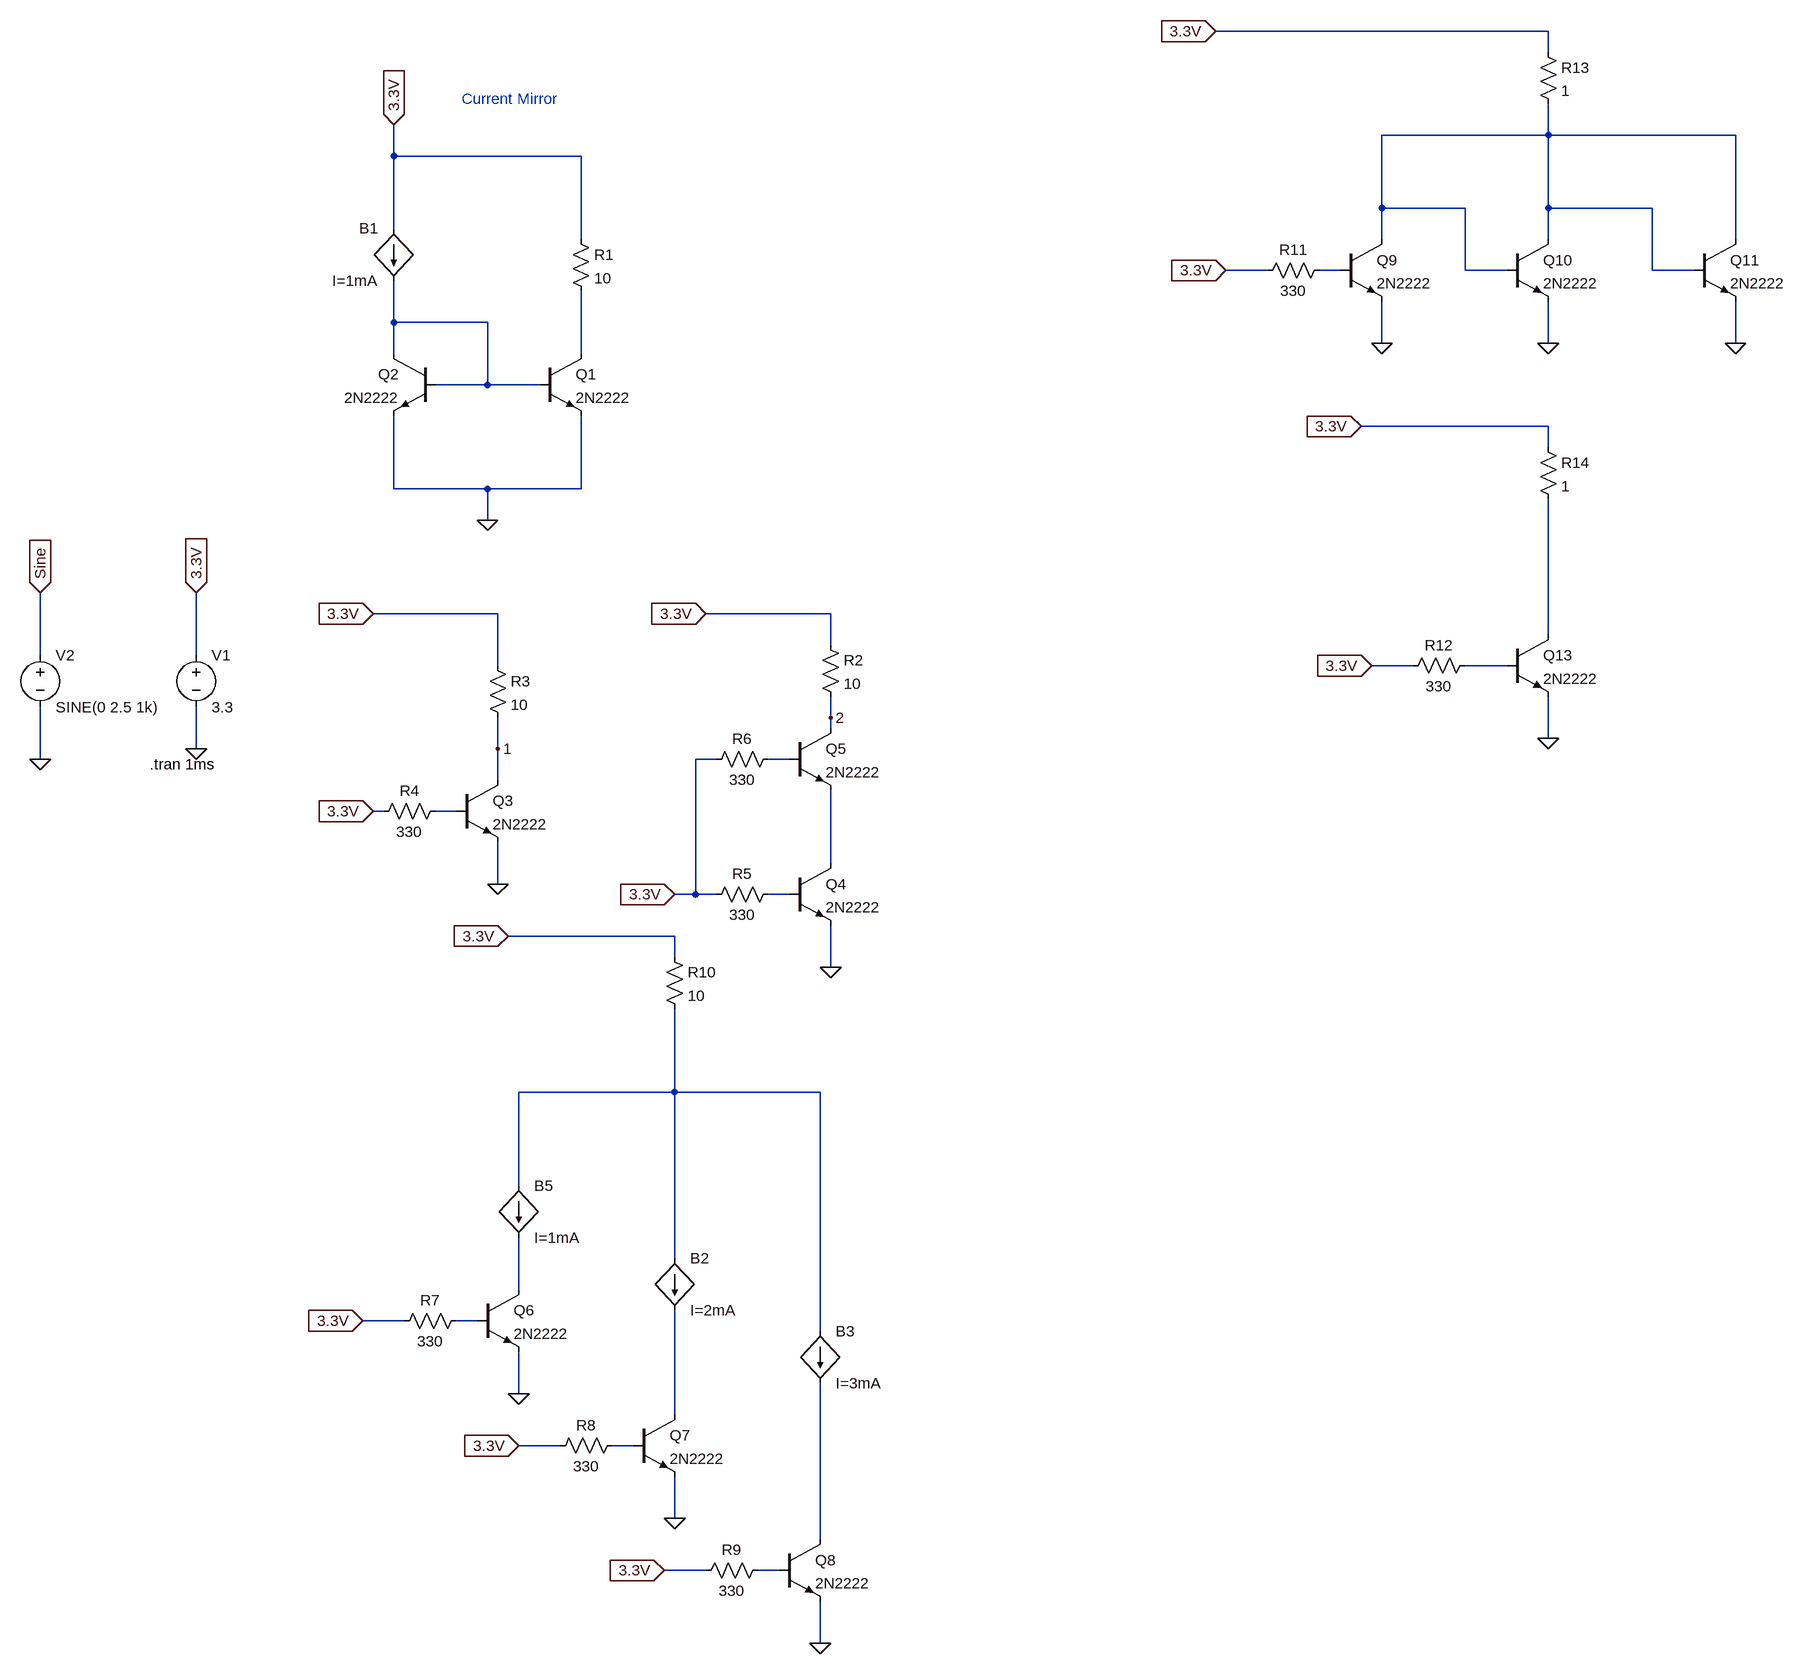
[diagram p0: schematic VLSI_Basic.asc]
VLSI_Basic.asc, the LTspice schematic file:
Version 4
SHEET 1 2536 1540
WIRE 2160 -960 1648 -960
WIRE 2160 -928 2160 -960
WIRE 2160 -800 2160 -848
WIRE 2160 -800 1904 -800
WIRE 2448 -800 2160 -800
WIRE 384 -768 384 -816
WIRE 672 -768 384 -768
WIRE 1904 -688 1904 -800
WIRE 2032 -688 1904 -688
WIRE 2160 -688 2160 -800
WIRE 2320 -688 2160 -688
WIRE 384 -656 384 -768
WIRE 672 -640 672 -768
WIRE 1904 -640 1904 -688
WIRE 2160 -640 2160 -688
WIRE 2448 -640 2448 -800
WIRE 1728 -592 1664 -592
WIRE 1840 -592 1808 -592
WIRE 2032 -592 2032 -688
WIRE 2096 -592 2032 -592
WIRE 2320 -592 2320 -688
WIRE 2384 -592 2320 -592
WIRE 384 -512 384 -576
WIRE 528 -512 384 -512
WIRE 1904 -480 1904 -544
WIRE 2160 -480 2160 -544
WIRE 2448 -480 2448 -544
WIRE 384 -464 384 -512
WIRE 672 -464 672 -560
WIRE 528 -416 528 -512
WIRE 528 -416 448 -416
WIRE 608 -416 528 -416
WIRE 2160 -352 1872 -352
WIRE 2160 -320 2160 -352
WIRE 384 -256 384 -368
WIRE 528 -256 384 -256
WIRE 672 -256 672 -368
WIRE 672 -256 528 -256
WIRE 528 -208 528 -256
WIRE 544 -64 352 -64
WIRE 1056 -64 864 -64
WIRE 2160 -32 2160 -240
WIRE 1056 -16 1056 -64
WIRE -160 0 -160 -96
WIRE 80 0 80 -96
WIRE 544 16 544 -64
WIRE 1952 16 1888 16
WIRE 2096 16 2032 16
WIRE 1056 96 1056 64
WIRE 1056 112 1056 96
WIRE 2160 128 2160 64
WIRE 80 144 80 80
WIRE 544 144 544 96
WIRE -160 160 -160 80
WIRE 880 160 848 160
WIRE 992 160 960 160
WIRE 544 192 544 144
WIRE 368 240 352 240
WIRE 480 240 448 240
WIRE 1056 320 1056 208
WIRE 544 352 544 288
WIRE 848 368 848 160
WIRE 848 368 816 368
WIRE 880 368 848 368
WIRE 992 368 960 368
WIRE 816 432 560 432
WIRE 816 464 816 432
WIRE 1056 480 1056 416
WIRE 816 672 816 544
WIRE 816 672 576 672
WIRE 1040 672 816 672
WIRE 576 816 576 672
WIRE 816 928 816 672
WIRE 576 976 576 896
WIRE 400 1024 336 1024
WIRE 512 1024 480 1024
WIRE 1040 1040 1040 672
WIRE 576 1136 576 1072
WIRE 816 1168 816 1008
WIRE 640 1216 576 1216
WIRE 752 1216 720 1216
WIRE 816 1328 816 1264
WIRE 1040 1360 1040 1120
WIRE 864 1408 800 1408
WIRE 976 1408 944 1408
WIRE 1040 1520 1040 1456
FLAG 80 144 0
FLAG 80 -96 3.3V
IOPIN 80 -96 In
FLAG 384 -816 3.3V
IOPIN 384 -816 In
FLAG 528 -208 0
FLAG 352 -64 3.3V
IOPIN 352 -64 In
FLAG 544 352 0
FLAG -160 160 0
FLAG -160 -96 Sine
IOPIN -160 -96 In
FLAG 864 -64 3.3V
IOPIN 864 -64 In
FLAG 1056 480 0
FLAG 352 240 3.3V
IOPIN 352 240 In
FLAG 816 368 3.3V
IOPIN 816 368 In
FLAG 544 144 1
FLAG 1056 96 2
FLAG 576 1136 0
FLAG 336 1024 3.3V
IOPIN 336 1024 In
FLAG 816 1328 0
FLAG 576 1216 3.3V
IOPIN 576 1216 In
FLAG 1040 1520 0
FLAG 800 1408 3.3V
IOPIN 800 1408 In
FLAG 560 432 3.3V
IOPIN 560 432 In
FLAG 1904 -480 0
FLAG 1664 -592 3.3V
IOPIN 1664 -592 In
FLAG 2160 -480 0
FLAG 2448 -480 0
FLAG 1648 -960 3.3V
IOPIN 1648 -960 In
FLAG 1888 16 3.3V
IOPIN 1888 16 In
FLAG 2160 128 0
FLAG 1872 -352 3.3V
IOPIN 1872 -352 In
SYMBOL voltage 80 -16 R0
SYMATTR InstName V1
SYMATTR Value 3.3
SYMBOL npn 608 -464 R0
SYMATTR InstName Q1
SYMATTR Value 2N2222
SYMBOL npn 448 -464 M0
SYMATTR InstName Q2
SYMATTR Value 2N2222
SYMBOL bi2 384 -576 R180
WINDOW 0 24 81 Left 2
WINDOW 3 24 0 Left 2
SYMATTR InstName B1
SYMATTR Value I=1mA
SYMBOL res 656 -656 R0
SYMATTR InstName R1
SYMATTR Value 10
SYMBOL npn 480 192 R0
SYMATTR InstName Q3
SYMATTR Value 2N2222
SYMBOL voltage -160 -16 R0
WINDOW 123 0 0 Left 0
WINDOW 39 0 0 Left 0
SYMATTR InstName V2
SYMATTR Value SINE(0 2.5 1k)
SYMBOL npn 992 320 R0
SYMATTR InstName Q4
SYMATTR Value 2N2222
SYMBOL npn 992 112 R0
SYMATTR InstName Q5
SYMATTR Value 2N2222
SYMBOL res 1040 -32 R0
SYMATTR InstName R2
SYMATTR Value 10
SYMBOL res 528 0 R0
SYMATTR InstName R3
SYMATTR Value 10
SYMBOL res 464 224 R90
WINDOW 0 0 56 VBottom 2
WINDOW 3 32 56 VTop 2
SYMATTR InstName R4
SYMATTR Value 330
SYMBOL res 976 352 R90
WINDOW 0 0 56 VBottom 2
WINDOW 3 32 56 VTop 2
SYMATTR InstName R5
SYMATTR Value 330
SYMBOL res 976 144 R90
WINDOW 0 0 56 VBottom 2
WINDOW 3 32 56 VTop 2
SYMATTR InstName R6
SYMATTR Value 330
SYMBOL res 496 1008 R90
WINDOW 0 0 56 VBottom 2
WINDOW 3 32 56 VTop 2
SYMATTR InstName R7
SYMATTR Value 330
SYMBOL npn 512 976 R0
SYMATTR InstName Q6
SYMATTR Value 2N2222
SYMBOL res 736 1200 R90
WINDOW 0 0 56 VBottom 2
WINDOW 3 32 56 VTop 2
SYMATTR InstName R8
SYMATTR Value 330
SYMBOL npn 752 1168 R0
SYMATTR InstName Q7
SYMATTR Value 2N2222
SYMBOL res 960 1392 R90
WINDOW 0 0 56 VBottom 2
WINDOW 3 32 56 VTop 2
SYMATTR InstName R9
SYMATTR Value 330
SYMBOL npn 976 1360 R0
SYMATTR InstName Q8
SYMATTR Value 2N2222
SYMBOL res 800 448 R0
SYMATTR InstName R10
SYMATTR Value 10
SYMBOL bi 576 816 R0
SYMATTR InstName B5
SYMATTR Value I=1mA
SYMBOL bi 816 928 R0
SYMATTR InstName B2
SYMATTR Value I=2mA
SYMBOL bi 1040 1040 R0
SYMATTR InstName B3
SYMATTR Value I=3mA
SYMBOL res 1824 -608 R90
WINDOW 0 0 56 VBottom 2
WINDOW 3 32 56 VTop 2
SYMATTR InstName R11
SYMATTR Value 330
SYMBOL npn 1840 -640 R0
SYMATTR InstName Q9
SYMATTR Value 2N2222
SYMBOL npn 2096 -640 R0
SYMATTR InstName Q10
SYMATTR Value 2N2222
SYMBOL npn 2384 -640 R0
SYMATTR InstName Q11
SYMATTR Value 2N2222
SYMBOL res 2144 -944 R0
SYMATTR InstName R13
SYMATTR Value 1
SYMBOL res 2048 0 R90
WINDOW 0 0 56 VBottom 2
WINDOW 3 32 56 VTop 2
SYMATTR InstName R12
SYMATTR Value 330
SYMBOL npn 2096 -32 R0
SYMATTR InstName Q13
SYMATTR Value 2N2222
SYMBOL res 2144 -336 R0
SYMATTR InstName R14
SYMATTR Value 1
TEXT 8 168 Left 2 !.tran 1ms
TEXT 488 -856 Left 2 ;Current Mirror

The netlist it stands for:
* VLSI_Basic.asc
V1 3.3V 0 3.3
Q1 N004 N003 0 0 2N2222
Q2 N003 N003 0 0 2N2222
B1 3.3V N003 I=1mA
R1 3.3V N004 10
Q3 1 N008 0 0 2N2222
V2 Sine 0 SINE(0 2.5 1k)
Q4 N009 N010 0 0 2N2222
Q5 2 N007 N009 0 2N2222
R2 3.3V 2 10
R3 3.3V 1 10
R4 N008 3.3V 330
R5 N010 3.3V 330
R6 N007 3.3V 330
R7 N013 3.3V 330
Q6 N012 N013 0 0 2N2222
R8 N015 3.3V 330
Q7 N014 N015 0 0 2N2222
R9 N017 3.3V 330
Q8 N016 N017 0 0 2N2222
R10 3.3V N011 10
B5 N011 N012 I=1mA
B2 N011 N014 I=2mA
B3 N011 N016 I=3mA
R11 N002 3.3V 330
Q9 N001 N002 0 0 2N2222
Q10 N001 N001 0 0 2N2222
Q11 N001 N001 0 0 2N2222
R13 3.3V N001 1
R12 N006 3.3V 330
Q13 N005 N006 0 0 2N2222
R14 3.3V N005 1
.model NPN NPN
.model PNP PNP
.lib standard.bjt
.tran 1ms
* Current Mirror
.backanno
.end